# Altium project superhet1.PrjPcb (part 2 of 2)
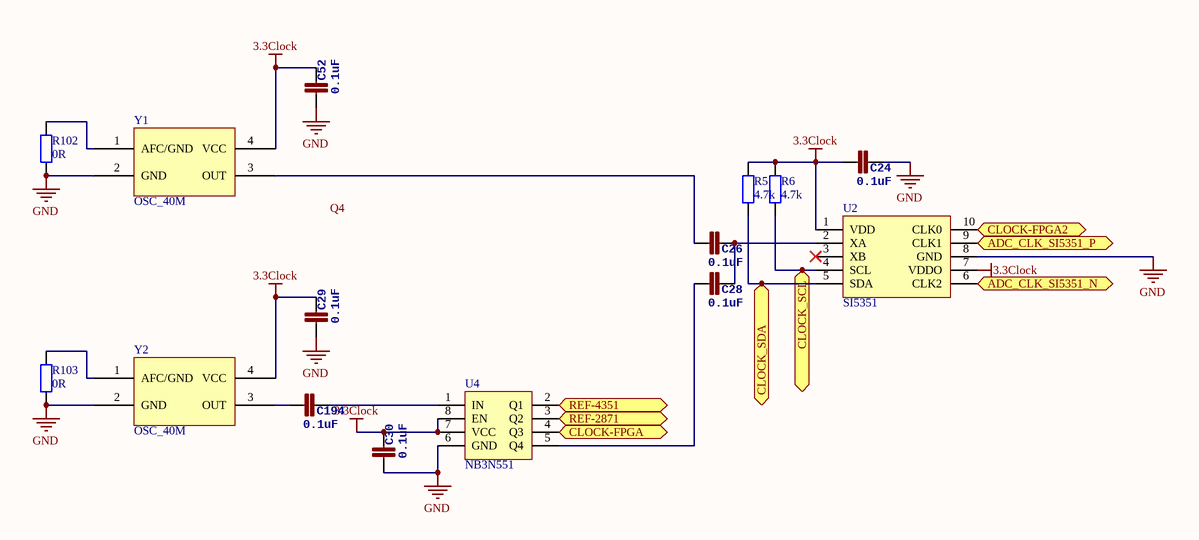
[diagram p9: clock.SchDoc]

## Nets that join several sheets
1.2: FPGA (10 pins), mcu (R106.1 R107.1), power (C189.2 L9.2 R108.2 U30.4)
1.8: USB_HS_PHY (C27.1 U20.28 U20.30), power (C54.2 L17.2 R11.2 U3.4)
1.8ADC: LF_ADC (16 pins), power (C176.2 U26.5)
3.3Clock: power (C177.2 U27.5), clock (12 pins)
3.3D: LF_ADC (8 pins), FPGA (46 pins), mcu (17 pins), USB_HS_PHY (7 pins), power (C7.2 C56.2 L18.2 R1.2)
3.3FE: front_end (6 pins), power (C220.2 U34.5)
3.3IF1: mix2_LO2 (C154.2 L6.1), power (C192.2 U31.5)
3.3LO1: mix1_LO1 (5 pins), power (C178.2 U28.5)
3.3LO2: mix2_LO2 (5 pins), power (C45.2 U7.5)
5V: mcu (P2.1), USB_HS_PHY (R46.1 R60.1), power (12 pins)
5V-A: mix1_LO1 (R80.1), power (7 pins)
GND: front_end (30 pins), mix1_LO1 (82 pins), mix2_LO2 (54 pins), LF_ADC (31 pins), FPGA (48 pins), mcu (14 pins), USB_HS_PHY (10 pins), power (74 pins), clock (10 pins)
VCC-IF: LF_ADC (R70.1 R71.2), power (C202.2 U33.5)
ADC_CLK_FPGA_N: LF_ADC (C173.1), FPGA (U1.C10)
ADC_CLK_FPGA_P: LF_ADC (C172.1), FPGA (U1.E10)
ADC_DATA_A0: LF_ADC (U6.27), FPGA (U1.A4)
ADC_DATA_A1: LF_ADC (U6.29), FPGA (U1.A5)
ADC_DATA_A2: LF_ADC (U6.30), FPGA (U1.B6)
ADC_DATA_A3: LF_ADC (U6.31), FPGA (U1.A6)
ADC_DATA_A4: LF_ADC (U6.32), FPGA (U1.A7)
ADC_DATA_A5: LF_ADC (U6.33), FPGA (U1.B8)
ADC_DATA_A6: LF_ADC (U6.34), FPGA (U1.A8)
ADC_DATA_A7: LF_ADC (U6.35), FPGA (U1.A9)
ADC_DATA_A8: LF_ADC (U6.36), FPGA (U1.B10)
ADC_DATA_A9: LF_ADC (U6.38), FPGA (U1.A10)
ADC_DATA_A10: LF_ADC (U6.39), FPGA (U1.A11)
ADC_DATA_A11: LF_ADC (U6.40), FPGA (U1.B12)
ADC_DATA_A12: LF_ADC (U6.41), FPGA (U1.A12)
ADC_DATA_A13: LF_ADC (U6.42), FPGA (U1.A13)
AMP_IF: mix2_LO2 (R91.1 R92.1), FPGA (U1.R5)
BYP_IF: mix2_LO2 (R93.1 R94.1), FPGA (U1.R7)
CCLK: FPGA (U1.R11 U8.6), mcu (U24.89)
CS-ADC: LF_ADC (R96.1), FPGA (U1.C16)
CS-LF: LF_ADC (U9.12), FPGA (U1.F16)
CS-MAX2871: mix1_LO1 (R114.2), FPGA (U1.M16)
DATA: FPGA (U1.P10 U8.2), mcu (U24.32)
DONE: FPGA (R43.1 U1.P13), mcu (U24.29)
FE1: front_end (R65.1 R69.2), FPGA (U1.H16)
FE2: front_end (R55.2 R68.2), FPGA (U1.H15)
FE3: front_end (R13.2 R57.1 R63.2 R95.2), FPGA (U1.G16)
FPGA_CLK: FPGA (U1.H4), mcu (U24.67)
FPGA_CLK2: FPGA (U1.J4), mcu (U24.68)
FPGA_IO0: FPGA (U1.H2), mcu (U24.97)
FPGA_IO1: FPGA (U1.J1), mcu (U24.98)
FPGA_IO2: FPGA (U1.J3), mcu (U24.1)
FPGA_IO3: FPGA (U1.K1), mcu (U24.2)
FPGA_IO4: FPGA (U1.K2), mcu (U24.3)
FPGA_IO5: FPGA (U1.L1), mcu (U24.4)
FPGA_IO6: FPGA (U1.L3), mcu (U24.5)
FPGA_IO7: FPGA (U1.H1), mcu (U24.38)
FPGA_IO8: FPGA (U1.G1), mcu (U24.39)
FPGA_IO9: FPGA (U1.F2), mcu (U24.40)
FPGA_IO10: FPGA (U1.F1), mcu (U24.41)
FPGA_IO11: FPGA (U1.E2), mcu (U24.42)
FPGA_IO12: FPGA (U1.E1), mcu (U24.43)
FPGA_IO13: FPGA (U1.C2), mcu (U24.44)
FPGA_IO14: FPGA (U1.D1), mcu (U24.45)
FPGA_IO15: FPGA (U1.C1), mcu (U24.46)
FPGA_MCLK: FPGA (U1.H3), mcu (U24.66)
HSWAPEN: FPGA (R45#1.1), mcu (U24.57)
IF_800: mix1_LO1 (R76.1 R77.1), FPGA (U1.J14)
IF_900: mix1_LO1 (R74.1 R75.1), FPGA (U1.J16)
INIT_B: FPGA (U1.R3), mcu (U24.31)
LD-2871: mix1_LO1 (R116.2), FPGA (U1.K15)
MISO-2871: mix1_LO1 (R115.2), FPGA (U1.L14)
MOSI-2871: mix1_LO1 (R113.2), FPGA (U1.M15)
MOSI-LF: LF_ADC (U9.14), FPGA (U1.E16)
NetAnt2_1: front_end (Ant2.1 C71.1), mix1_LO1 (C129.2)
NetAnt3_1: mix1_LO1 (Ant3.1 U15.2), mix2_LO2 (C160.2)
NetAnt6_1: mix2_LO2 (Ant6.1 M1.2), LF_ADC (C82.2 R35.1 R105.1)
NetC108_2: mcu (U24.12), USB_HS_PHY (C108.2 R61.2 U20.25 X2.3)
NetC170_1: LF_ADC (C170.1), clock (U2.9)
NetC171_1: LF_ADC (C171.1), clock (U2.6)
NetC218_1: mix2_LO2 (C218.1), clock (U4.2)
NetC219_1: mix1_LO1 (C219.1), clock (U4.3)
NetR5_2: mcu (U24.71), clock (R5.2 U2.5)
NetR6_2: mcu (U24.70), clock (R6.2 U2.4)
NetR118_2: mix2_LO2 (R118.2), FPGA (U1.T7)
NetR119_2: mix2_LO2 (R119.2), FPGA (U1.T6)
NetR120_2: mix2_LO2 (R120.2), FPGA (U1.T5)
NetR121_2: mix2_LO2 (R121.2), FPGA (U1.T8)
NetR122_2: mix2_LO2 (R122.2), FPGA (U1.T9)
NetR123_2: mix2_LO2 (R123.2), FPGA (U1.T4)
NetU1_A14: LF_ADC (U6.43), FPGA (U1.A14)
NetU1_B2: FPGA (U1.B2), mcu (U24.81)
NetU1_C9: LF_ADC (U6.24), FPGA (U1.C9)
NetU1_H5: FPGA (U1.H5), clock (U4.4)
NetU1_J6: FPGA (U1.J6), clock (U2.10)
PC10: FPGA (U1.A2), mcu (U24.78)
PC11: FPGA (U1.A3), mcu (U24.79)
PC12: FPGA (U1.B1), mcu (U24.80)
PROGRAM: FPGA (R44.2 U1.T2), mcu (U24.23)
RFEN-2871: mix1_LO1 (R117.2), FPGA (U1.K16)
SCLK-2871: mix1_LO1 (R112.2), FPGA (U1.L16)
SCLK-ADC: LF_ADC (R97.1), FPGA (U1.D16)
SCLK-LF: LF_ADC (U9.13), FPGA (U1.F15)
SDATA-ADC: LF_ADC (R98.1), FPGA (U1.C15)
USB_HS_CK: mcu (U24.30), USB_HS_PHY (U20.1)
USB_HS_DIR: mcu (U24.17), USB_HS_PHY (U20.31)
USB_HS_NXT: mcu (U24.18), USB_HS_PHY (U20.2)
USB_HS_RESET: mcu (U24.8), USB_HS_PHY (R64.1 U20.27)
USB_HS_STP: mcu (U24.15), USB_HS_PHY (U20.29)